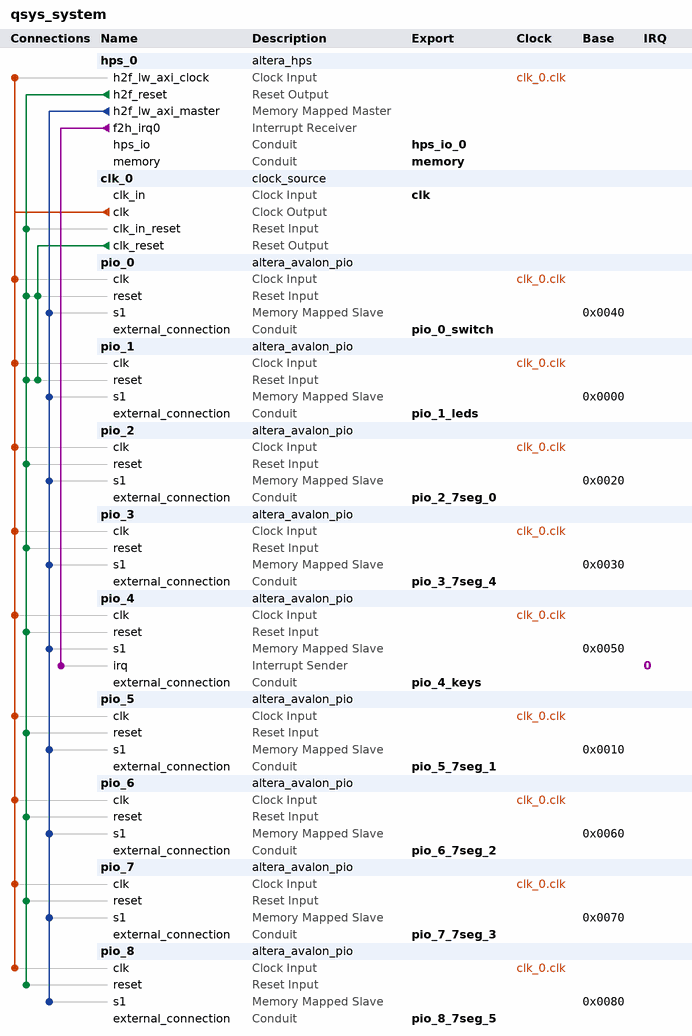
[diagram p0: system contents]
# Platform Designer (Qsys) system qsys_system, Cyclone V 5CSEMA5F31C6
# Parameters at their usual value, and those the tool derives, are not listed.
package require -exact qsys 17.0
create_system qsys_system
set_project_property DEVICE_FAMILY {Cyclone V}
set_project_property DEVICE 5CSEMA5F31C6

add_instance hps_0 altera_hps 17.0
set_instance_parameter_value hps_0 EMAC1_Mode N/A
set_instance_parameter_value hps_0 EMAC1_PinMuxing Unused
set_instance_parameter_value hps_0 F2SCLK_COLDRST_Enable false
set_instance_parameter_value hps_0 F2SCLK_DBGRST_Enable false
set_instance_parameter_value hps_0 F2SCLK_WARMRST_Enable false
set_instance_parameter_value hps_0 F2SINTERRUPT_Enable true
set_instance_parameter_value hps_0 F2S_Width 0
set_instance_parameter_value hps_0 FPGA_PERIPHERAL_OUTPUT_CLOCK_FREQ_EMAC0_GTX_CLK 125
set_instance_parameter_value hps_0 FPGA_PERIPHERAL_OUTPUT_CLOCK_FREQ_EMAC0_MD_CLK 2.5
set_instance_parameter_value hps_0 FPGA_PERIPHERAL_OUTPUT_CLOCK_FREQ_EMAC1_GTX_CLK 125
set_instance_parameter_value hps_0 FPGA_PERIPHERAL_OUTPUT_CLOCK_FREQ_EMAC1_MD_CLK 2.5
set_instance_parameter_value hps_0 HPS_PROTOCOL DDR3
set_instance_parameter_value hps_0 I2C0_Mode N/A
set_instance_parameter_value hps_0 I2C0_PinMuxing Unused
set_instance_parameter_value hps_0 I2C1_Mode N/A
set_instance_parameter_value hps_0 I2C1_PinMuxing Unused
set_instance_parameter_value hps_0 LWH2F_Enable true
set_instance_parameter_value hps_0 MEM_BANKADDR_WIDTH 3
set_instance_parameter_value hps_0 MEM_CLK_FREQ 400.0
set_instance_parameter_value hps_0 MEM_CLK_FREQ_MAX 400.0
set_instance_parameter_value hps_0 MEM_COL_ADDR_WIDTH 10
set_instance_parameter_value hps_0 MEM_DQ_WIDTH 32
set_instance_parameter_value hps_0 MEM_DRV_STR RZQ/7
set_instance_parameter_value hps_0 MEM_ROW_ADDR_WIDTH 15
set_instance_parameter_value hps_0 MEM_RTT_NOM RZQ/4
set_instance_parameter_value hps_0 MEM_RTT_WR RZQ/4
set_instance_parameter_value hps_0 MEM_TCL 11
set_instance_parameter_value hps_0 MEM_TFAW_NS 30.0
set_instance_parameter_value hps_0 MEM_TRAS_NS 35.0
set_instance_parameter_value hps_0 MEM_TRCD_NS 13.75
set_instance_parameter_value hps_0 MEM_TRFC_NS 260.0
set_instance_parameter_value hps_0 MEM_TRP_NS 13.75
set_instance_parameter_value hps_0 MEM_VENDOR JEDEC
set_instance_parameter_value hps_0 MEM_WTCL 8
set_instance_parameter_value hps_0 QSPI_Mode N/A
set_instance_parameter_value hps_0 QSPI_PinMuxing Unused
set_instance_parameter_value hps_0 REF_CLK_FREQ 25.0
set_instance_parameter_value hps_0 S2FCLK_USER2CLK 5
set_instance_parameter_value hps_0 S2F_Width 0
set_instance_parameter_value hps_0 SDIO_Mode N/A
set_instance_parameter_value hps_0 SDIO_PinMuxing Unused
set_instance_parameter_value hps_0 SPIM1_Mode N/A
set_instance_parameter_value hps_0 SPIM1_PinMuxing Unused
set_instance_parameter_value hps_0 STM_Enable false
set_instance_parameter_value hps_0 TIMING_BOARD_AC_SKEW 0.03
set_instance_parameter_value hps_0 TIMING_BOARD_AC_TO_CK_SKEW 0.0
set_instance_parameter_value hps_0 TIMING_BOARD_DQ_TO_DQS_SKEW 0.0
set_instance_parameter_value hps_0 TIMING_BOARD_MAX_CK_DELAY 0.03
set_instance_parameter_value hps_0 TIMING_BOARD_MAX_DQS_DELAY 0.02
set_instance_parameter_value hps_0 TIMING_BOARD_SKEW_BETWEEN_DQS 0.08
set_instance_parameter_value hps_0 TIMING_BOARD_SKEW_CKDQS_DIMM_MAX 0.16
set_instance_parameter_value hps_0 TIMING_BOARD_SKEW_CKDQS_DIMM_MIN 0.09
set_instance_parameter_value hps_0 TIMING_BOARD_SKEW_WITHIN_DQS 0.01
set_instance_parameter_value hps_0 TIMING_TDH 65
set_instance_parameter_value hps_0 TIMING_TDQSCK 255
set_instance_parameter_value hps_0 TIMING_TDQSQ 125
set_instance_parameter_value hps_0 TIMING_TDS 30
set_instance_parameter_value hps_0 TIMING_TIH 140
set_instance_parameter_value hps_0 TIMING_TIS 180
set_instance_parameter_value hps_0 TIMING_TQSH 0.4
set_instance_parameter_value hps_0 UART0_Mode N/A
set_instance_parameter_value hps_0 UART0_PinMuxing Unused
set_instance_parameter_value hps_0 USB1_Mode N/A
set_instance_parameter_value hps_0 USB1_PinMuxing Unused
set_instance_parameter_value hps_0 desired_cfg_clk_mhz 100.0
set_instance_parameter_value hps_0 desired_qspi_clk_mhz 400.0

add_instance clk_0 clock_source 17.0
set_instance_parameter_value clk_0 clockFrequency 50000000

add_instance pio_0 altera_avalon_pio 17.0
set_instance_parameter_value pio_0 direction Input
set_instance_parameter_value pio_0 width 10

add_instance pio_1 altera_avalon_pio 17.0
set_instance_parameter_value pio_1 direction Output
set_instance_parameter_value pio_1 resetValue 170
set_instance_parameter_value pio_1 width 10

add_instance pio_2 altera_avalon_pio 17.0
set_instance_parameter_value pio_2 direction Output
set_instance_parameter_value pio_2 resetValue 10
set_instance_parameter_value pio_2 width 7

add_instance pio_3 altera_avalon_pio 17.0
set_instance_parameter_value pio_3 direction Output
set_instance_parameter_value pio_3 resetValue 11
set_instance_parameter_value pio_3 width 7

add_instance pio_4 altera_avalon_pio 17.0
set_instance_parameter_value pio_4 captureEdge true
set_instance_parameter_value pio_4 direction Input
set_instance_parameter_value pio_4 edgeType FALLING
set_instance_parameter_value pio_4 generateIRQ true
set_instance_parameter_value pio_4 irqType EDGE
set_instance_parameter_value pio_4 width 4

add_instance pio_5 altera_avalon_pio 17.0
set_instance_parameter_value pio_5 direction Output
set_instance_parameter_value pio_5 resetValue 11
set_instance_parameter_value pio_5 width 7

add_instance pio_6 altera_avalon_pio 17.0
set_instance_parameter_value pio_6 direction Output
set_instance_parameter_value pio_6 width 7

add_instance pio_7 altera_avalon_pio 17.0
set_instance_parameter_value pio_7 direction Output
set_instance_parameter_value pio_7 width 7

add_instance pio_8 altera_avalon_pio 17.0
set_instance_parameter_value pio_8 direction Output
set_instance_parameter_value pio_8 width 7

# connections
add_connection clk_0.clk hps_0.h2f_lw_axi_clock clock
add_connection clk_0.clk pio_0.clk clock
add_connection clk_0.clk pio_1.clk clock
add_connection clk_0.clk pio_2.clk clock
add_connection clk_0.clk pio_3.clk clock
add_connection clk_0.clk pio_4.clk clock
add_connection clk_0.clk pio_5.clk clock
add_connection clk_0.clk pio_6.clk clock
add_connection clk_0.clk pio_7.clk clock
add_connection clk_0.clk pio_8.clk clock
add_connection clk_0.clk_reset pio_0.reset reset
add_connection clk_0.clk_reset pio_1.reset reset
add_connection hps_0.h2f_reset clk_0.clk_in_reset reset
add_connection hps_0.h2f_reset pio_0.reset reset
add_connection hps_0.h2f_reset pio_1.reset reset
add_connection hps_0.h2f_reset pio_2.reset reset
add_connection hps_0.h2f_reset pio_3.reset reset
add_connection hps_0.h2f_reset pio_4.reset reset
add_connection hps_0.h2f_reset pio_5.reset reset
add_connection hps_0.h2f_reset pio_6.reset reset
add_connection hps_0.h2f_reset pio_7.reset reset
add_connection hps_0.h2f_reset pio_8.reset reset
add_connection hps_0.h2f_lw_axi_master pio_0.s1 avalon
set_connection_parameter_value hps_0.h2f_lw_axi_master/pio_0.s1 baseAddress 0x0040
add_connection hps_0.h2f_lw_axi_master pio_1.s1 avalon
set_connection_parameter_value hps_0.h2f_lw_axi_master/pio_1.s1 baseAddress 0x0000
add_connection hps_0.h2f_lw_axi_master pio_2.s1 avalon
set_connection_parameter_value hps_0.h2f_lw_axi_master/pio_2.s1 baseAddress 0x0020
add_connection hps_0.h2f_lw_axi_master pio_3.s1 avalon
set_connection_parameter_value hps_0.h2f_lw_axi_master/pio_3.s1 baseAddress 0x0030
add_connection hps_0.h2f_lw_axi_master pio_4.s1 avalon
set_connection_parameter_value hps_0.h2f_lw_axi_master/pio_4.s1 baseAddress 0x0050
add_connection hps_0.h2f_lw_axi_master pio_5.s1 avalon
set_connection_parameter_value hps_0.h2f_lw_axi_master/pio_5.s1 baseAddress 0x0010
add_connection hps_0.h2f_lw_axi_master pio_6.s1 avalon
set_connection_parameter_value hps_0.h2f_lw_axi_master/pio_6.s1 baseAddress 0x0060
add_connection hps_0.h2f_lw_axi_master pio_7.s1 avalon
set_connection_parameter_value hps_0.h2f_lw_axi_master/pio_7.s1 baseAddress 0x0070
add_connection hps_0.h2f_lw_axi_master pio_8.s1 avalon
set_connection_parameter_value hps_0.h2f_lw_axi_master/pio_8.s1 baseAddress 0x0080
add_connection hps_0.f2h_irq0 pio_4.irq interrupt
set_connection_parameter_value hps_0.f2h_irq0/pio_4.irq irqNumber 0

# exported interfaces
add_interface clk clock sink
set_interface_property clk EXPORT_OF clk_0.clk_in
add_interface hps_io_0 conduit end
set_interface_property hps_io_0 EXPORT_OF hps_0.hps_io
add_interface memory conduit end
set_interface_property memory EXPORT_OF hps_0.memory
add_interface pio_0_switch conduit end
set_interface_property pio_0_switch EXPORT_OF pio_0.external_connection
add_interface pio_1_leds conduit end
set_interface_property pio_1_leds EXPORT_OF pio_1.external_connection
add_interface pio_2_7seg_0 conduit end
set_interface_property pio_2_7seg_0 EXPORT_OF pio_2.external_connection
add_interface pio_3_7seg_4 conduit end
set_interface_property pio_3_7seg_4 EXPORT_OF pio_3.external_connection
add_interface pio_4_keys conduit end
set_interface_property pio_4_keys EXPORT_OF pio_4.external_connection
add_interface pio_5_7seg_1 conduit end
set_interface_property pio_5_7seg_1 EXPORT_OF pio_5.external_connection
add_interface pio_6_7seg_2 conduit end
set_interface_property pio_6_7seg_2 EXPORT_OF pio_6.external_connection
add_interface pio_7_7seg_3 conduit end
set_interface_property pio_7_7seg_3 EXPORT_OF pio_7.external_connection
add_interface pio_8_7seg_5 conduit end
set_interface_property pio_8_7seg_5 EXPORT_OF pio_8.external_connection

set_interconnect_requirement {$system} qsys_mm.clockCrossingAdapter HANDSHAKE
set_interconnect_requirement {$system} qsys_mm.enableEccProtection FALSE
set_interconnect_requirement {$system} qsys_mm.insertDefaultSlave FALSE
set_interconnect_requirement {$system} qsys_mm.maxAdditionalLatency 1

save_system qsys_system.qsys
